# Altium schematic sheet MCU.SchDoc
size A4
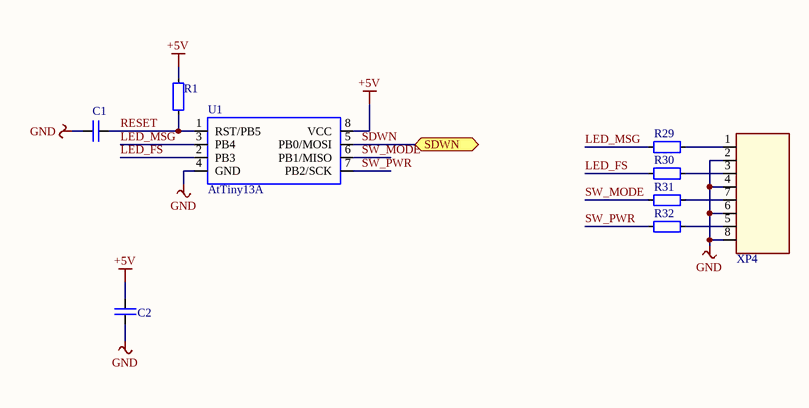
[diagram p0: MCU.SchDoc]

## Parts
C1  (no value)  [SMD_0805]
C2  (no value)  [SMD_0805]
R1  (no value)  [SMD_0805]
R29  (no value)  [SMD_0805]
R30  (no value)  [SMD_0805]
R31  (no value)  [SMD_0805]
R32  (no value)  [SMD_0805]
U1  AtTiny13A  [SO8-150mil]
XP4  CON_8  [HEAD-1/8/2.54]  (value not drawn)

## Ports
SDWN

## Nets
+5V: C2.1 R1.2 U1.8(VCC)
GND: C1.1 C2.2 U1.4(GND) XP4.2 XP4.4 XP4.6 XP4.8
LED_FS: R30.2 U1.2(PB3)
LED_MSG: R29.2 U1.3(PB4)
RESET: C1.2 R1.1 U1.1(RST/PB5)
SDWN: U1.5(PB0/MOSI) ; port SDWN
SW_MODE: R31.2 U1.6(PB1/MISO)
SW_PWR: R32.2 U1.7(PB2/SCK)
NetR29_1: R29.1 XP4.1
NetR30_1: R30.1 XP4.3
NetR31_1: R31.1 XP4.7
NetR32_1: R32.1 XP4.5

## Library data of the parts
C1 C2 = C_NONE_POLAR: None polar capacitor
R1 R29-R32 = RES: Resistor